# EAGLE design Explore-Labs-3D-Accelerometer-3D-Magnetometer-LSM303D-Compass-Breakout-Board (EAGLE 7.5.0)
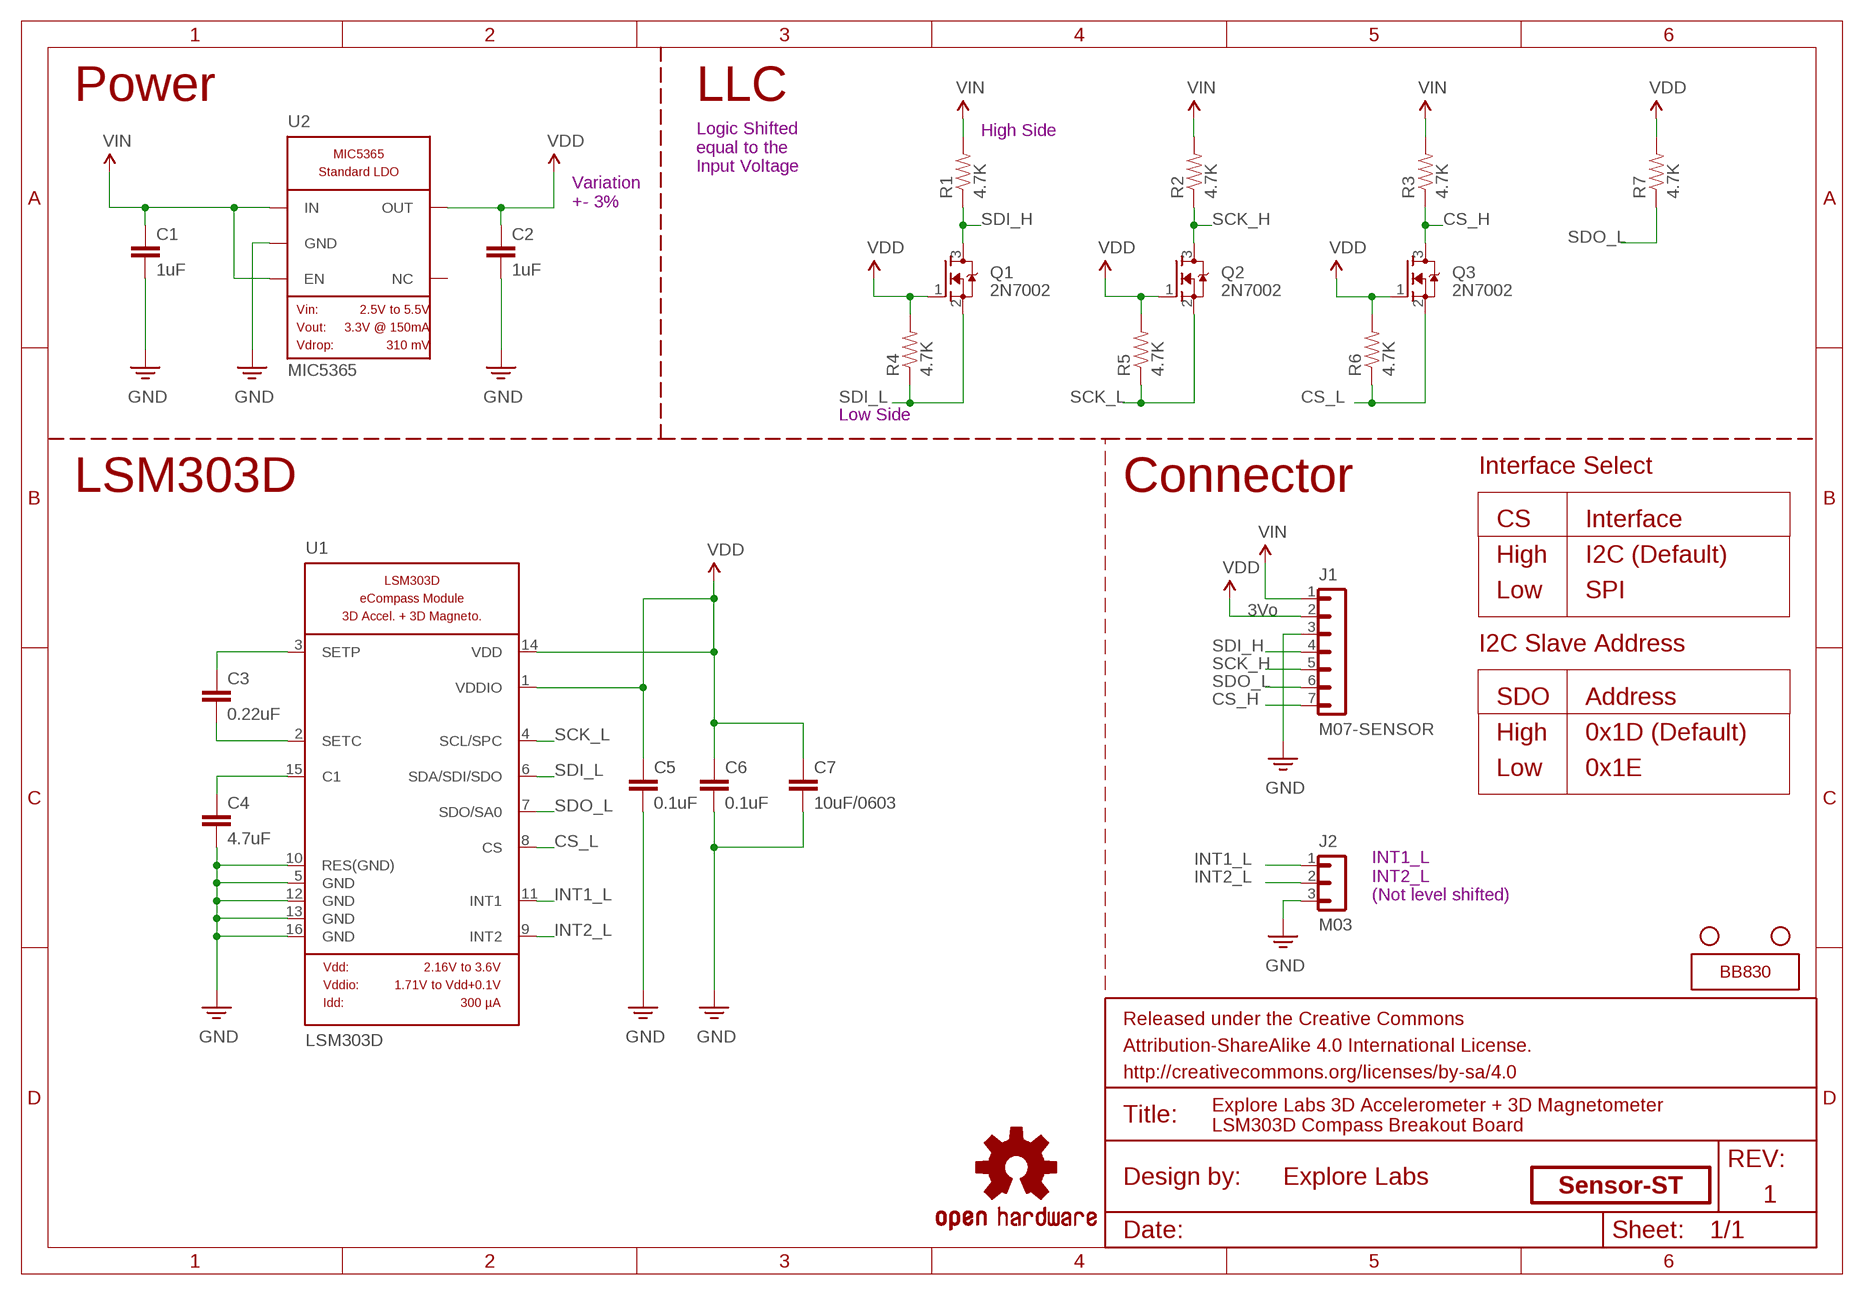
[diagram p0: schematic, sheet 1]

## Parts
C1  1uF  CAPACITOR-0402  [0402-CAP]
C2  1uF  CAPACITOR-0402  [0402-CAP]
C3  0.22uF  CAPACITOR-0402  [0402-CAP]
C4  4.7uF  CAPACITOR-0402  [0402-CAP]
C5  0.1uF  CAPACITOR-0402  [0402-CAP]
C6  0.1uF  CAPACITOR-0402  [0402-CAP]
C7  10uF/0603  CAPACITOR-0603  [0603-CAP]
H1  STAND-OFF  [STAND-OFF]
H2  STAND-OFF  [STAND-OFF]
J1  M07-SENSOR  [1X07-SENSOR-SPI]
J2  M03  [1X03]
Q1  2N7002  MOSFET-N-2N7002P  [SOT23]
Q2  2N7002  MOSFET-N-2N7002P  [SOT23]
Q3  2N7002  MOSFET-N-2N7002P  [SOT23]
R1  4.7K  RESISTOR-0402  [0402-RES]
R2  4.7K  RESISTOR-0402  [0402-RES]
R3  4.7K  RESISTOR-0402  [0402-RES]
R4  4.7K  RESISTOR-0402  [0402-RES]
R5  4.7K  RESISTOR-0402  [0402-RES]
R6  4.7K  RESISTOR-0402  [0402-RES]
R7  4.7K  RESISTOR-0402  [0402-RES]
U1  LSM303D  [LGA16-LSM303D]
U2  MIC5365  [SOT23-LDO]
ZZ1  EXPLORE-LABS-LOGO-2-0.25  [EXLABS_LOGO_0.25]
ZZ2  OSHW-LOGOBOTTOM  [OSHW-LOGO-M-BOTTOM]
ZZ3  SENSOR-ST  [SENSOR-ST]
ZZ4  BREADBOARD-830  [BREADBOARD-830]

## Nets
CS_H: J1.7 Q3.3(D) R3.1
CS_L: Q3.2(S) R6.1 U1.8(CS)
GND: C1.2 C2.2 C4.2 C5.2 C6.2 C7.2 J1.3 J2.3 U1.5(GND) U1.10(RES(GND)) U1.12(GND) U1.13(GND) U1.16(GND) U2.2(GND)
INT1_L: J2.1 U1.11(INT1)
INT2_L: J2.2 U1.9(INT2)
N$2: C4.1 U1.15(C1)
N$3: C3.2 U1.2(SETC)
N$4: C3.1 U1.3(SETP)
SCK_H: J1.5 Q2.3(D) R2.1
SCK_L: Q2.2(S) R5.1 U1.4(SCL/SPC)
SDI_H: J1.4 Q1.3(D) R1.1
SDI_L: Q1.2(S) R4.1 U1.6(SDA/SDI/SDO)
SDO_L: J1.6 R7.1 U1.7(SDO/SA0)
VDD: C2.1 C5.1 C6.1 C7.1 J1.2 Q1.1(G) Q2.1(G) Q3.1(G) R4.2 R5.2 R6.2 R7.2 U1.1(VDDIO) U1.14(VDD) U2.5(OUT)
VIN: C1.1 J1.1 R1.2 R2.2 R3.2 U2.1(IN) U2.3(EN)
Unconnected: U2.4(NC)

## Notes on the sheet
- Power | LLC
- High Side
- Logic Shifted
  equal to the
  Input Voltage
- Variation
  +- 3%
- Low Side
- Interface Select
- LSM303D | Connector
- CS | Interface
- High | I2C (Default)
- Low | SPI
- 3Vo
- I2C Slave Address
- SDO | Address
- High | 0x1D (Default)
- Low | 0x1E
- INT1_L
  INT2_L
  (Not level shifted)
- Explore Labs 3D Accelerometer + 3D Magnetometer
  LSM303D Compass Breakout Board
- 1

## Library data of the parts
C1-C7 = Explore Labs EAGLE Library:CAPACITOR
H1 H2 = Explore Labs EAGLE Library:STAND-OFF: #4 Stand Off This is the mechanical footprint for a #4 phillips button head screw. Use the keepout ring to avoid running the screw head into surrounding components. SKU : PRT-00447
J1 = Explore Labs EAGLE Library:M07: Header 7 Standard 7-pin 0.1" header. Use with straight break away headers or right angle break away headers.
J2 = Explore Labs EAGLE Library:M03
Q1-Q3 = Explore Labs EAGLE Library:MOSFET-N: 2N7002P 60 V, 360 mA N-channel Trench MOSFET. N-channel enhancement mode Field-Effect Transistor (FET) in a small SOT23 (TO-236AB) Surface-Mounted Device (SMD) plastic package using Trench MOSFET technology. VDS (drain-source voltage) = 60 V (max.) VGS (gate-source voltage) = -20 V to 20 V ID (drain current) = 360 mA RDSon (drain-source on-state resistance) = 1.6 ohm (max.) VGSth (gate-source threshold voltage) = 1.1 V (min.), 1.75 V (typ.), 2.4 V (max.)
R1-R7 = Explore Labs EAGLE Library:RESISTOR
U1 = Explore Labs EAGLE Library:LSM303D: LSM303D Ultra-compact high-performance eCompass module: 3D accelerometer and 3D magnetometer Datasheet - DM00057547 Date - November 2013 DocID - 023312 Rev 2
U2 = Explore Labs EAGLE Library:MIC5365
ZZ1 = Explore Labs EAGLE Library:EXPLORE-LABS-LOGO-2: Explore Labs Logo
ZZ2 = Explore Labs EAGLE Library:OSHW-LOGO: Open Source Hardware Logo This logo indicates the piece of hardware it is found on incorporates an OSHW license and/or adheres to the definition of open source hardware found here: http://freedomdefined.org/OSHW
ZZ3 = Explore Labs EAGLE Library:SENSOR-ST
ZZ4 = Explore Labs EAGLE Library:BREADBOARD-830

## Board
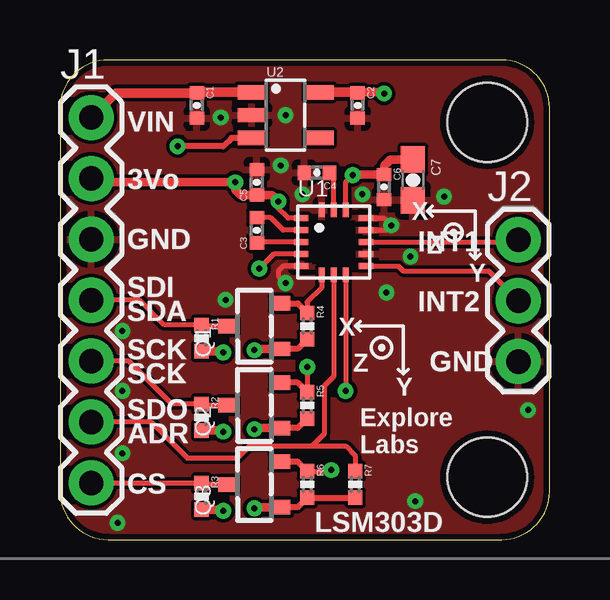
[diagram p1: board, top side]
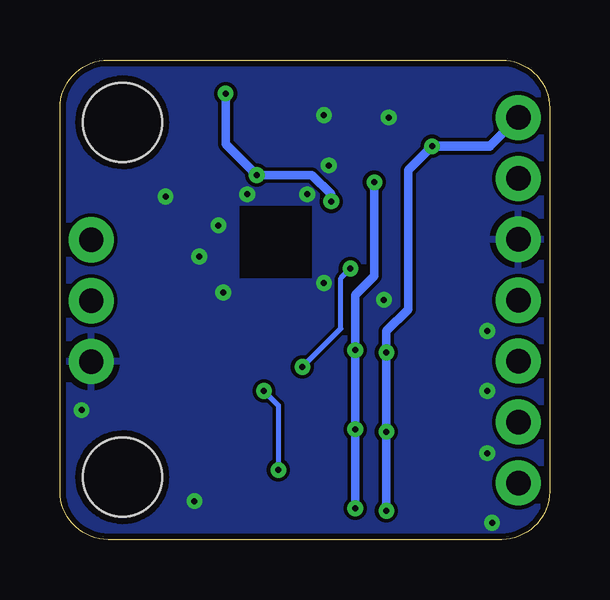
[diagram p2: board, bottom side, seen from below]

Size 20.4 x 20 mm. Coordinates in mm from the lower left corner, seen from the top.
Outline: 0,18 0,2 arc90 2,0 18.4,0 arc90 20.4,2 20.4,18 arc90 18.4,20 2,20 arc90 0,18
Copper layers (1*16): Top 0.035mm / dielectric 1.5mm / Bottom 0.035mm
Design rules "Explore Labs 2 Layer Mar-2016 - Standard Manufacturer": minimum track width 0.15mm, minimum drill 0.25mm, track to track 0.15mm, track to pad 0.15mm, pad to pad 0.15mm, via to via 0.15mm, smd to smd 0.15mm, copper to edge 0.25mm, drill to drill 0.15mm, minimum pad ring 10mil, minimum via ring 8mil, stop-mask expansion 0.1mm, vias tented up to drill 0.35mm, thermal gap 10mil
tRestrict: area 10.5,11.5 to 12.3,13.3; 3 lines
bRestrict: area 9.9,10.9 to 12.9,13.9

### Footprints (pad centres in the part's own frame; a part is rotated, then mirrored left to right if it is on the bottom)
0402-CAP = smd 0.55 x 0.6: 1 -0.525,0; 2 0.525,0
0603-CAP = smd 1.1 x 1: 1 -0.85,0; 2 0.85,0
STAND-OFF = hole 3.302: 0,0
1X07-SENSOR-SPI = drill 1.016 pad 1.88: 1 0,0; 2 0,-2.54; 3 0,-5.08; 4 0,-7.62; 5 0,-10.16; 6 0,-12.7; 7 0,-15.24
1X03 = drill 1.016 pad 1.88: 1 0,0; 2 0,-2.54; 3 0,-5.08
SOT23 = smd 0.6 x 0.8: 1 -0.95,-1.1; 2 0.95,-1.1; 3 0,1.1
0402-RES = smd 0.6 x 0.6: 1 -0.55,0; 2 0.55,0
LGA16-LSM303D = smd 0.6 x 0.25: 1 -1.35,1; 2 -1.35,0.5; 3 -1.35,0; 4 -1.35,-0.5; 5 -1.35,-1; 9 1.35,-1; 10 1.35,-0.5; 11 1.35,0; 12 1.35,0.5; 13 1.35,1 | smd 0.25 x 0.6: 6 -0.5,-1.35; 7 0,-1.35; 8 0.5,-1.35; 14 0.5,1.35; 15 0,1.35; 16 -0.5,1.35
SOT23-LDO = smd 1.2 x 0.6: 1 -1.4,0.95; 2 -1.4,0; 3 -1.4,-0.95; 4 1.4,-0.95; 5 1.4,0.95

### Placement (x,y rotation side)
C1  5.7,18.1 270 top
C2  12.4,18.1 270 top
C3  8.2,12.9 90 top
C4  10.7,15.3 180 top
C5  8.2,14.9 90 top
C6  13.5,14.7 270 top
C7  14.7,15 270 top
H1  17.8,17.4 0 top
H2  17.8,2.6 0 top
J1  1.3,17.6 0 top
J2  19.1,12.5 0 top
Q1  8.1,8.9 90 top
Q2  8.1,5.6 90 top
Q3  8.1,2.3 90 top
R1  5.9,8.4 270 top
R2  5.9,5.1 270 top
R3  5.9,1.8 270 top
R4  10.3,8.9 270 top
R5  10.3,5.6 270 top
R6  10.3,2.3 270 top
R7  12.3,2.3 270 top
U1  11.4,12.4 0 top
U2  9.4,17.7 0 top
ZZ1  15.3,15.9 0 bottom
ZZ2  10.2,3.7 0 top
ZZ3  0,0 0 top
ZZ4  37.5,-0.8 90 top  (outside the outline)

### Tracks (layer width: path | path; a pad name or v marks a point on that pad's centre or on a via)
CS_H
  Top 0.2: Q3.3 5.95,2.3 R3.1 J1.7
CS_L  (via drill 0.25)
  Top 0.2: U1.8 v11.9,6.2 | R6.1 11.25,2.85 v11.3,2.9
  Top 0.25: R6.1 9.9,3.25 Q3.2
  Bottom 0.2: v11.9,6.2 11.3,5.6 v11.3,2.9
GND  (via drill 0.25)
  Top 0.2: U1.12 13.6,12.9 v13.8,13.1 13.5,13.4 U1.13 | U1.5 9.3,11.4 9.1,11.2 9.1,11 v9.4,10.7
  Top 0.25: 12.7,13.4 U1.13 13.2,13.4 | 12.7,12.9 U1.12 13.2,12.9
  other vias: 10.1,14.4 2.4,0.7 14.8,1.6 19.5,5.4 2.6,3.6 2.6,6.2 2.6,8.7 6.7,17.6 9.4,17.7 6.9,10 13.6,10.3 14.6,11.8 12.6,14.4 16,14.3 9.2,15.6
  pour Top: 0,0 0,20 20.4,20 20.4,0
  pour Bottom: 0,0 0,20 20.4,20 20.4,0
INT1_L
  Top 0.2: U1.11 19,12.4 J2.1
INT2_L
  Top 0.2: U1.9 14.1,11.4 14.3,11.2 17.86,11.2 J2.2
N$2
  Top 0.2: U1.15 11.4,15.12 C4.1
N$3
  Top 0.2: U1.2 9.3,12.9 8.78,13.43 C3.2
N$4
  Top 0.2: U1.3 8.22,12.4 C3.1
SCK_H
  Top 0.2: Q2.3 5.95,5.6 R2.1 4.65,5.65 2.86,7.44 J1.5
SCK_L  (via drill 0.25)
  Top 0.2: v10.3,7.2 R5.1 | U1.4 8.9,11.9 v8.3,11.3
  Top 0.25: R5.1 9.9,6.55 Q2.2
  Bottom 0.2: v8.3,11.3 8.7,10.9 8.7,8.8 v10.3,7.2
SDI_H
  Top 0.2: Q1.3 5.95,8.9 R1.1 4.35,8.95 3.32,9.98 J1.4
SDI_L
  Top 0.2: U1.6 10.9,10.5 10.3,9.9 R4.1
  Top 0.25: Q1.2 9.9,9.85 R4.1
SDO_L
  Top 0.2: 10.5,3.9 7.9,3.9 7.4,3.4 5.3,3.4 3.8,4.9 J1.6 | 10.5,3.9 11.9,3.9 12.3,3.5 R7.1 | 10.5,3.9 11,4.4 11,6.4 11.4,6.8 U1.7
VDD  (via drill 0.25)
  Top 0.2: U1.14 11.9,14.9 v12.2,15.2 | U1.1 9.5,13.4 9.1,13.8 v9.1,14.1
  Top 0.25: Q3.1 9.9,1.35 R6.2 R7.2 | R5.2 9.9,4.65 Q2.1 | R4.2 9.9,7.95 Q1.1
  Top 0.35: 12.38,18.65 13.45,18.65 v13.5,18.6 | Q3.1 8.15,1.35 v8.1,1.3 | Q2.1 8.15,4.65 v8.1,4.6 | Q1.1 8.15,7.95 v8.1,7.9 | v9.1,14.1 8.82,14.38 C5.1 7.53,14.38 7.3,14.6 v7.3,14.9 1.46,14.9 J1.2 | C7.1 13.75,15.85 13.5,15.6 C6.1 12.22,15.22 v12.2,15.2
  Top 0.4: U2.5 12.38,18.65 C2.1
  Bottom 0.35: v13.5,18.6 13.5,16.5 v12.2,15.2 9.9,15.2 9.1,14.4 v9.1,14.1 | v7.3,14.9 7.3,11 8.1,10.2 v8.1,7.9 v8.1,4.6 v8.1,1.3
VIN  (via drill 0.25)
  Top 0.25: U2.3 7.15,16.75 6.8,16.4 v4.9,16.4
  Top 0.35: R3.2 6.75,1.25 v6.8,1.2 | R2.2 6.75,4.55 v6.8,4.5 | R1.2 6.75,7.85 v6.8,7.8
  Top 0.4: U2.1 5.72,18.65 C1.1 2.33,18.62 J1.1
  Bottom 0.35: v4.9,16.4 5.9,15.4 5.9,9.6 6.8,8.7 v6.8,7.8 v6.8,4.5 v6.8,1.2
  Bottom 0.4: v4.9,16.4 2.5,16.4 J1.1

### Text on the board
tPlace: VIN | 3Vo | GND | INT1 | SDI | INT2 | SDA | SCK | GND | SCK | SDO | ADR | CS
_tsilk: VIN | 3Vo | GND | INT1 | SDI | INT2 | SDA | SCK | X | Z | GND | SCL | Y | SDO | ADR | Explore / Labs | CS | LSM303D
_bsilk: ST LSM303D | 3D Accel + 3D Mag | I2C or SPI | 5V Ready IOs | Vin: 2.5V to 5V | 3Vo: 3.3V @ 150mA | Made In India